# Altium schematic sheet Regulator.SchDoc: Regulator
size A4; Organization: Gateway; Address1: University of Colorado; Address2: Boulder; DocumentNumber: 3; Revision: 1; SheetNumber: 3; SheetTotal: 6
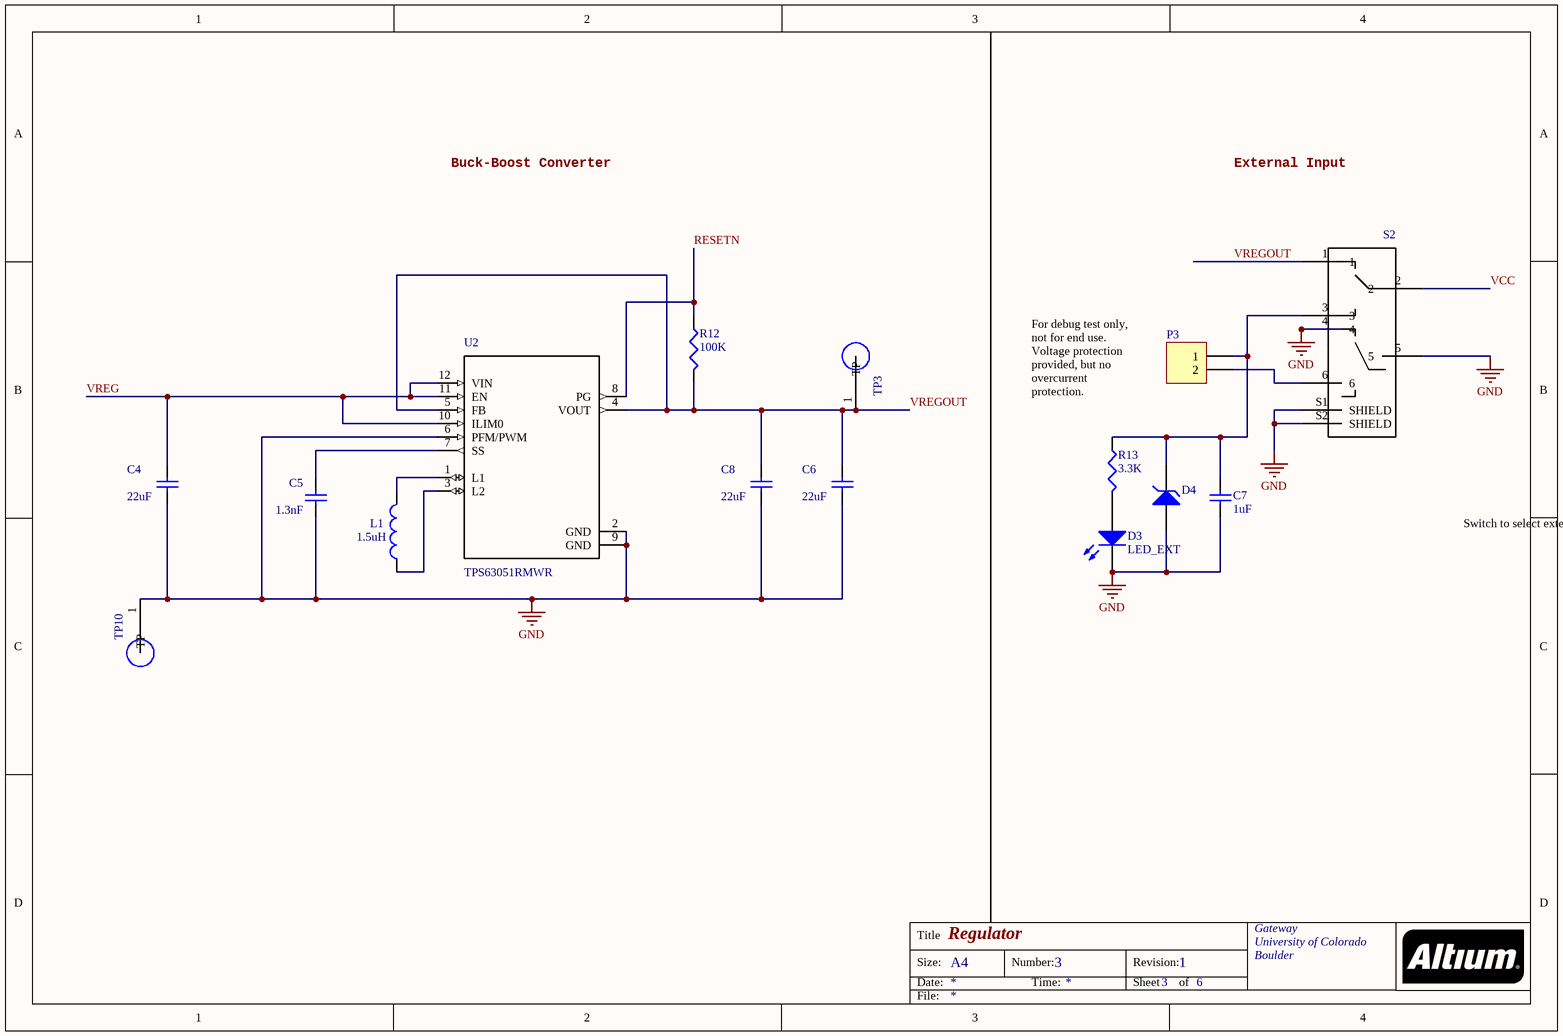
[diagram p0: Regulator.SchDoc]

## Parts
C4  value 22uF  [1608[0603]]  (hidden comment: CL10A226MPCNUBE)
C5  value 1.3nF  [1608[0603]]  (hidden comment: C0603C132J3GAC7867)
C6  value 22uF  [1608[0603]]  (hidden comment: CL10A226MPCNUBE)
C7  value 1uF  [1608[0603]]  (hidden comment: CL10B105KP8NNNC)
C8  value 22uF  [1608[0603]]  (hidden comment: CL10A226MPCNUBE)
D3  LED_EXT  [1608[0603]]
D4  CZRQR3V3B-HF  [0402]  (value not drawn)
L1  value 1.5uH  [1608[0603]]  (hidden comment: LQM18PN1R5MFHD)
P3  (no value)  [HDR1X2]
R12  value 100K  [1608[0603]]  (hidden comment: RG1608P-104-B-T5)
R13  value 3.3K  [1608[0603]]  (hidden comment: ERJ-3GEYJ332V)
S2  1825289-1  [SW_1825289-1_1825289-1(Primary)]  (value not drawn)
TP3  VREGOUT_TP  [TP380X203]  (value not drawn)
TP10  GND_TP  [TP380X203]  (value not drawn)
U2  TPS63051RMWR  [QFN50P250X250X100-12N]

## Nets
GND: C4.1 C5.1 C6.1 C7.1 C8.1 D3.2(K) D4.1(A) S2.4 S2.5 S2.S1(SHIELD) S2.S2(SHIELD) TP10.1(TP) U2.2(GND) U2.6(PFM/PWM) U2.9(GND)
RESETN: R12.1 U2.8(PG)
VCC: S2.2
VREG: C4.2 U2.10(ILIM0) U2.11(EN) U2.12(VIN)
VREGOUT: C6.2 C8.2 R12.2 S2.1 TP3.1(TP) U2.4(VOUT) U2.5(FB)
NetC5_2: C5.2 U2.7(SS)
NetC7_2: C7.2 D4.2(K) P3.1 R13.2 S2.3
NetD3_1: D3.1(A) R13.1
NetL1_1: L1.1 U2.3(L2)
NetL1_2: L1.2 U2.1(L1)
NetP3_2: P3.2 S2.6

## Notes on the sheet
- Buck-Boost Converter
- External Input
- For debug test only, not for end use. Voltage protection provided, but no overcurrent protection.
- (near C7) Switch to select external supply
- Title
- Size:
- Date:
- A4
- Number:
- Time:
- Revision:
- Sheet
- of
- File:

## Library data of the parts
C4 C6 C8 = Cap: CAP CER 22UF 10V X5R 0603; Manufacturer: Samsung Electro-Mechanics; Published: 8-Jun-2000; LatestRevisionDate: 17-Jul-2002; LatestRevisionNote: Re-released for DXP Platform.; PackageReference: RAD-0.3; Publisher: Altium Limited; PackageDescription: Radial Cap, Thru-Hole; 2 Leads; 0.3 in Pin Spacing; ComponentLink1URL: https://www.digikey.com/product-detail/en/samsung-electro-mechanics/CL10A226MPCNUBE/1276-6504-1-ND/5961363; ComponentLink1Description: Digi-Key Link; Manufacturer Part Number: CL10A226MPCNUBE; Digi-Key Part Number: 1276-6504-1-ND
C5 = Cap: CAP CER 1300PF 25V C0G/NP0 0603; Manufacturer: KEMET; Published: 8-Jun-2000; LatestRevisionDate: 17-Jul-2002; LatestRevisionNote: Re-released for DXP Platform.; PackageReference: RAD-0.3; Publisher: Altium Limited; PackageDescription: Radial Cap, Thru-Hole; 2 Leads; 0.3 in Pin Spacing; ComponentLink1URL: https://www.digikey.com/product-detail/en/kemet/C0603C132J3GAC7867/399-14953-1-ND/7382502; ComponentLink1Description: Digi-Key Link; Manufacturer Part Number: C0603C132J3GAC7867; Digi-Key Part Number: 399-14953-1-ND
C7 = Cap Semi: CAP CER 1UF 10V X7R 0603; Manufacturer: Samsung Electro-Mechanics; Digi-Key Part Number: 1276-1946-1-ND; Manufacturer Part Number: CL10B105KP8NNNC; ComponentLink1URL: https://www.digikey.com/product-detail/en/samsung-electro-mechanics/CL10B105KP8NNNC/1276-1946-1-ND/3890032; ComponentLink1Description: Digi-Key Link
D3 = LED2: LED GREEN DIFFUSED 0603 SMD; Manufacturer: OSRAM Opto Semiconductors Inc.; Manufacturer Part Number: LG L29K-F2J1-24-Z; Digi-Key Part Number: 475-3118-1-ND; ComponentLink1URL: https://www.digikey.com/product-detail/en/osram-opto-semiconductors-inc/LG-L29K-F2J1-24-Z/475-3118-1-ND/4899549; ComponentLink1Description: Digi-Key Link
D4 = D Zener: DIODE ZENER 3.3V 125MW 0402; Manufacturer: Comchip Technology; ComponentLink1Description: Digi-Key Link; Value: *; Manufacturer Part Number: CZRQR3V3B-HF; Digi-Key Part Number: 641-1682-1-ND; ComponentLink1URL: https://www.digikey.com/product-detail/en/comchip-technology/CZRQR3V3B-HF/641-1682-1-ND/5147319
L1 = Inductor: FIXED IND 1.5UH 1.1A 213 MOHM; Manufacturer: Murata Electronics North America; Code_IEC: 1005; PackageReference: 0402-A; Published: 8-Jun-2000; LatestRevisionDate: 29-May-2009; LatestRevisionNote: IPC-7351 Footprint Added.; Publisher: Altium Limited; PackageDescription: Chip Inductor; Code_JEITA: 0402; Manufacturer Part Number: LQM18PN1R5MFHD; Digi-Key Part Number: 490-15637-1-ND; ComponentLink1URL: https://www.digikey.com/product-detail/en/murata-electronics-north-america/LQM18PN1R5MFHD/490-15637-1-ND/6800302; ComponentLink1Description: Digi-Key Link
P3 = Header 2: Header, 2-Pin; LatestRevisionDate: 17-Jul-2002; LatestRevisionNote: Re-released for DXP Platform.; Publisher: Altium Limited
R12 = Res3: RES SMD 100K OHM 0.1% 1/10W 0603; Manufacturer: Susumu; PackageReference: J1-0603; Published: 8-Jun-2000; LatestRevisionDate: 29-May-2009; LatestRevisionNote: IPC-7351 Footprint Added.; Publisher: Altium Limited; PackageDescription: Chip Resistor; Manufacturer Part Number: RG1608P-104-B-T5; Digi-Key Part Number: RG16P100KBCT-ND; ComponentLink1URL: https://www.digikey.com/products/en/resistors/chip-resistor-surface-mount/52?k=RG1608P-104-B-T5&k=&pkeyword=RG1608P-104-B-T5&pv7=2&sf=0&quantity=&ColumnSort=0&page=1&pageSize=25; ComponentLink1Description: Digi-Key Link
R13 = Res3: RES SMD 3.3K OHM 5% 1/10W 0603; Manufacturer: Panasonic Electronic Components; Digi-Key Part Number: P3.3KGCT-ND; ComponentLink1URL: https://www.digikey.com/product-detail/en/panasonic-electronic-components/ERJ-3GEYJ332V/P3.3KGCT-ND/135146; ComponentLink1Description: Digi-Key URL; Manufacturer Part Number: ERJ-3GEYJ332V
S2 = 1825289-1: MHS22204=DPDT SL SW VERT AG; Manufacturer: TE Connectivity; Manufacturer Part Number: 1825289-1; ComponentLink1URL: https://www.digikey.com/products/en?keywords=MHS22204; ComponentLink1Description: Digi-Key Link; Digi-Key Part Number: 450-1572-ND
TP3 TP10 = 5019: PC TEST POINT MINIATURE; Manufacturer: Keystone Electronics; MF: Keystone; MP: 5019; Package: 2010 Keystone; Digi-Key_Part_Number: 36-5019CT-ND; ComponentLink1URL: https://www.digikey.com/product-detail/en/keystone-electronics/5019/36-5019CT-ND/3907344?utm_source=snapeda&utm_medium=aggregator&utm_campaign=symbol; SnapEDA_Link: https://www.snapeda.com/parts/5019/Keystone%20Electronics/view-part/?ref=snap; Value: *; ComponentLink1Description: Digi-Key Link; Manufacturer Part Number: 5019; Digi-Key Part Number: 36-5019CT-ND
U2 = TPS63051RMWR: Tiny Single Inductor Buck Boost Converter 12-VQFN -40 to 85; Manufacturer: Texas Instruments; ComponentLink1Description: Digi-Key Link; ComponentLink1URL: https://www.digikey.com/products/en/integrated-circuits-ics/pmic-voltage-regulators-dc-dc-switching-regulators/739?k=TPS63051RMWR&k=&pkeyword=TPS63051RMWR&pv7=2&sf=0&quantity=&ColumnSort=0&page=1&pageSize=25; Digi-Key Part Number: 296-42650-1-ND; Manufacturer Part Number: TPS63051RMWR